# EAGLE design main (EAGLE 8.6.3)
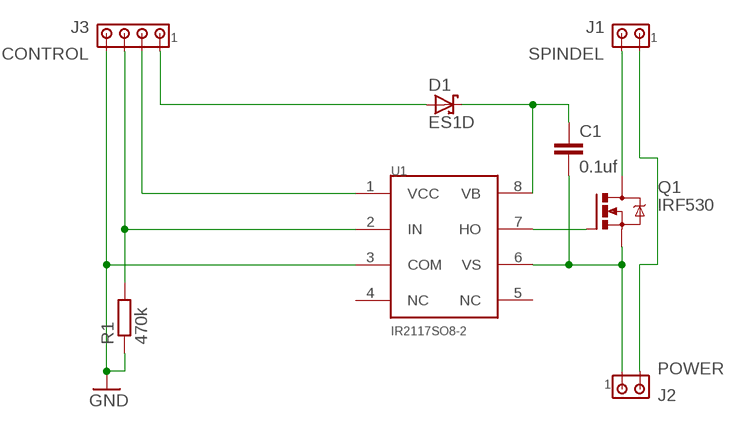
[diagram p0: schematic, sheet 1]

## Parts
C1  0.1uf  C-EUC0805K  [C0805K]
D1  ES1D  SCHOTTKY-DIODESMD  [SMB]
J1  SPINDEL  MTA02-100  [10X02MTA]
J2  POWER  MTA02-100  [10X02MTA]
J3  CONTROL  MTA04-100  [10X04MTA]
Q1  IRF530  [TO220BV]
R1  470k  R-EU_R0603  [R0603]
U1  IR2117SO8-2  [SO8-2]

## Nets
GATE: Q1.G U1.7(HO)
GND: J3.4 R1.1 U1.3(COM)
GND_48V: C1.2 J2.1 Q1.S U1.6(VS)
PWM: J3.3 R1.2 U1.2(IN)
SPINDEL: J1.2 Q1.D
VB: C1.1 D1.C U1.8(VB)
VCC_5V: J3.2 U1.1(VCC)
VCC_12V: D1.A J3.1
VCC_48V: J1.1 J2.2
Unconnected: U1.4(NC) U1.5(NC)

## Library data of the parts
C1 = rcl:C-EU: CAPACITOR, European symbol; SPICEPREFIX: C
D1 = diode:SCHOTTKY-DIODE: Schottky Diode
J1 J2 = con-amp:MTA02-100: AMP connector
J3 = con-amp:MTA04-100: AMP connector
Q1 = transistor-power:IRF530: HEXFET Power MOSFET
R1 = resistor:R-EU_: RESISTOR, European symbol
U1 = irf-2:IR2117: High side driver

## Board
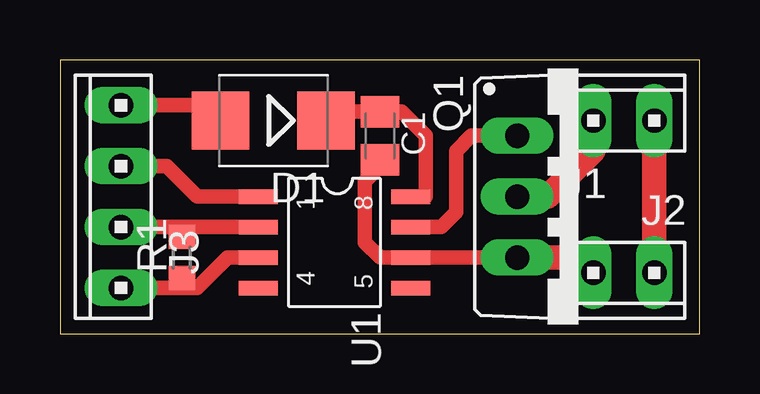
[diagram p1: board, top side]

Size 26.66 x 11.42 mm. Coordinates in mm from the lower left corner, seen from the top.
Outline: 0,0 26.66,0 26.66,11.42 0,11.42 0,0
Copper layers (1*16): Top 0.035mm / dielectric 1.5mm / Bottom 0.035mm
Design rules "default": minimum track width 6mil, minimum drill 0.35mm, track to track 6mil, track to pad 6mil, pad to pad 6mil, via to via 6mil, smd to smd 6mil, copper to edge 40mil, drill to drill 6mil, minimum pad ring 10mil, minimum via ring 8mil, stop-mask expansion 4mil, vias tented up to drill 0mil, thermal gap 10mil

### Footprints (pad centres in the part's own frame; a part is rotated, then mirrored left to right if it is on the bottom)
C0805K = smd 1.3 x 1.6: 1 -1,0; 2 1,0
SMB = smd 2.4 x 2.4: A 2.2,0; C -2.2,0
10X02MTA = drill 1.016 long: 1 1.27,0; 2 -1.27,0
10X04MTA = drill 1.016 long: 1 3.81,0; 2 1.27,0; 3 -1.27,0; 4 -3.81,0
TO220BV = drill 1.016 long: D 0,-2.54; G -2.54,-2.54; S 2.54,-2.54
R0603 = smd 1 x 1.1: 1 -0.85,0; 2 0.85,0
SO8-2 = smd 0.61 x 1.626: 1 -2.54,-2.54; 2 -1.27,-2.54; 3 0,-2.54; 4 1.27,-2.54; 5 1.27,3.81; 6 0,3.81; 7 -1.27,3.81; 8 -2.54,3.81

### Placement (x,y rotation side)
C1  13.34,8.26 270 top
D1  8.89,8.89 180 top
J1  23.5,8.89 0 top
J2  23.5,2.54 180 top
J3  2.54,5.71 90 top
Q1  21.59,5.71 270 top
R1  5.08,3.17 90 top
U1  10.79,3.17 270 top

### Tracks (layer width: path | path; a pad name or v marks a point on that pad's centre or on a via)
GATE
  Top 0.61: U1.7 15.88,4.45 16.51,5.08 16.51,7.62 17.14,8.26 Q1.G
GND
  Top 0.61: J3.4 5.08,1.91 | 5.08,1.91 R1.1 | U1.3 6.99,3.17 5.71,1.91 5.08,1.91
GND_48V
  Top 0.61: Q1.S U1.6 13.34,3.17 12.7,3.81 12.7,6.35 13.34,6.99 C1.2
  Top 1.016: J2.1 21.59,3.17 Q1.S
PWM
  Top 0.61: U1.2 5.08,4.45 | 5.08,4.45 J3.3 | R1.2 5.08,4.45
SPINDEL
  Top 1.016: Q1.D 20.32,5.71 22.23,7.62 J1.2
VB
  Top 0.61: U1.8 15.24,5.71 15.24,8.26 14.24,9.26 C1.1 11.7,9.26 11.43,9.53 11.09,9.19 D1.C
VCC_5V
  Top 0.61: U1.1 5.71,5.71 4.45,6.99 J3.2
VCC_12V
  Top 0.61: D1.A 6.05,9.53 J3.1
VCC_48V
  Top 1.016: J1.1 J2.2